# Altium schematic sheet BatteryBackpacks.SchDoc
size A
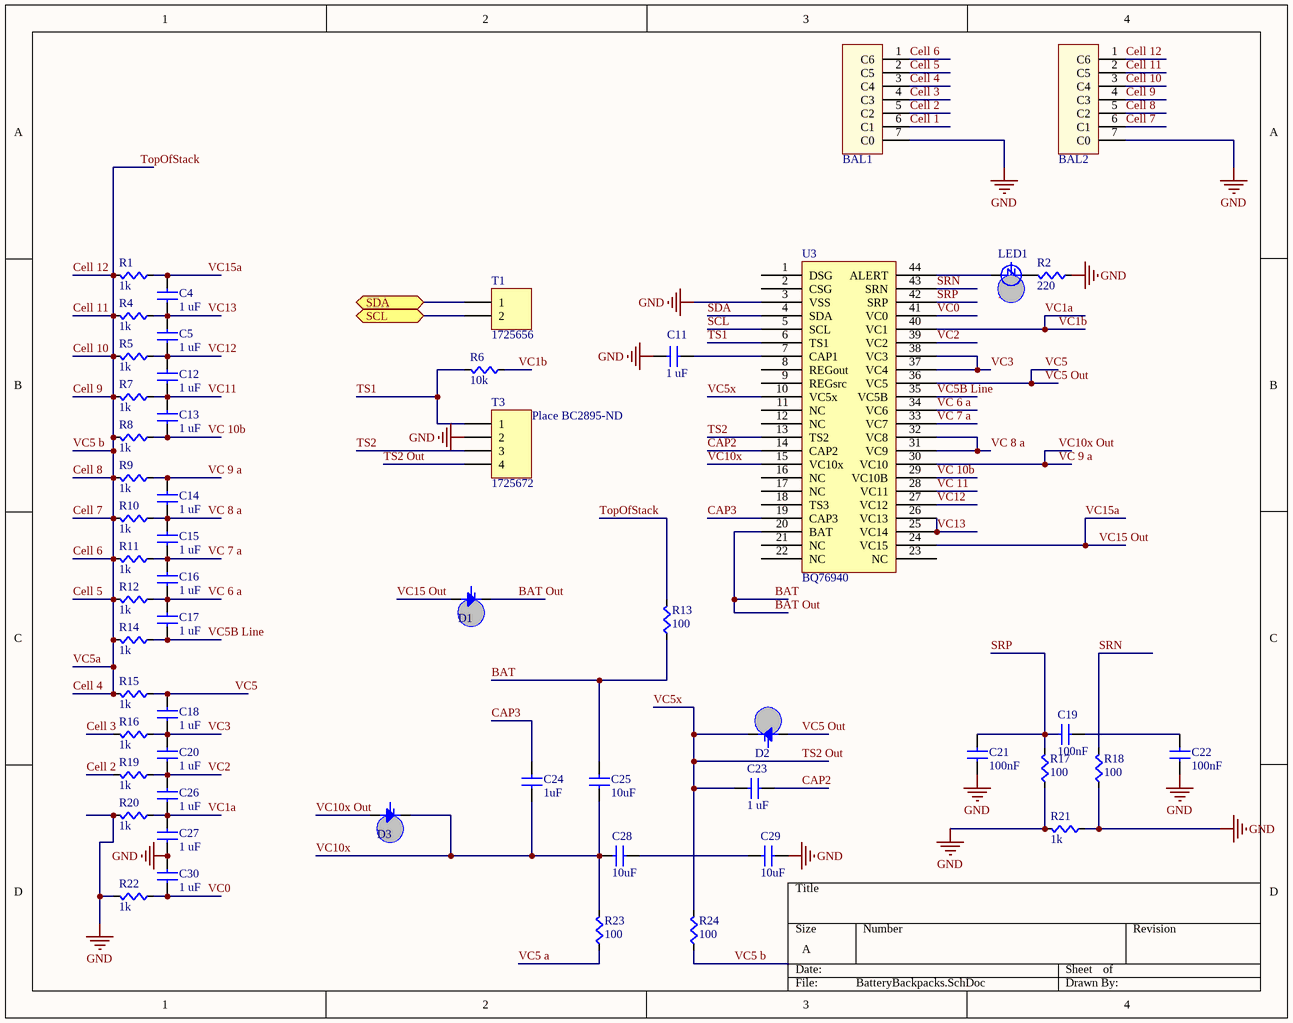
[diagram p0: BatteryBackpacks.SchDoc]

## Parts
BAL1  JST1x7  [JST1x7]  (value not drawn)
BAL2  JST1x7  [JST1x7]  (value not drawn)
C4  value 1 uF  [CAPC0603]  (hidden comment: Cap)
C5  value 1 uF  [CAPC0603]  (hidden comment: Cap)
C11  value 1 uF  [CAPC0603]  (hidden comment: Cap)
C12  value 1 uF  [CAPC0603]  (hidden comment: Cap)
C13  value 1 uF  [CAPC0603]  (hidden comment: Cap)
C14  value 1 uF  [CAPC0603]  (hidden comment: Cap)
C15  value 1 uF  [CAPC0603]  (hidden comment: Cap)
C16  value 1 uF  [CAPC0603]  (hidden comment: Cap)
C17  value 1 uF  [CAPC0603]  (hidden comment: Cap)
C18  value 1 uF  [CAPC0603]  (hidden comment: Cap)
C19  value 100nF  [CAPC0603]  (hidden comment: Cap)
C20  value 1 uF  [CAPC0603]  (hidden comment: Cap)
C21  value 100nF  [CAPC0603]  (hidden comment: Cap)
C22  value 100nF  [CAPC0603]  (hidden comment: Cap)
C23  value 1 uF  [CAPC0603]  (hidden comment: Cap)
C24  value 1uF  [CAPC0603]  (hidden comment: Cap)
C25  value 10uF  [CAPC0603]  (hidden comment: Cap)
C26  value 1 uF  [CAPC0603]  (hidden comment: Cap)
C27  value 1 uF  [CAPC0603]  (hidden comment: Cap)
C28  value 10uF  [CAPC0603]  (hidden comment: Cap)
C29  value 10uF  [CAPC0603]  (hidden comment: Cap)
C30  value 1 uF  [CAPC0603]  (hidden comment: Cap)
D1  Diode  [TEMD5510FX01]  (value not drawn)
D2  Diode  [TEMD5510FX01]  (value not drawn)
D3  Diode  [TEMD5510FX01]  (value not drawn)
LED1  Color: Red  [LED0603]  (hidden comment: LED)
R1  value 1k  [RES0603]  (hidden comment: Res)
R2  value 220  [RES0603]  (hidden comment: Res)
R4  value 1k  [RES0603]  (hidden comment: Res)
R5  value 1k  [RES0603]  (hidden comment: Res)
R6  value 10k  [RES0603]  (hidden comment: Res)
R7  value 1k  [RES0603]  (hidden comment: Res)
R8  value 1k  [RES0603]  (hidden comment: Res)
R9  value 1k  [RES0603]  (hidden comment: Res)
R10  value 1k  [RES0603]  (hidden comment: Res)
R11  value 1k  [RES0603]  (hidden comment: Res)
R12  value 1k  [RES0603]  (hidden comment: Res)
R13  value 100  [RES0603]  (hidden comment: Res)
R14  value 1k  [RES0603]  (hidden comment: Res)
R15  value 1k  [RES0603]  (hidden comment: Res)
R16  value 1k  [RES0603]  (hidden comment: Res)
R17  value 100  [RES0603]  (hidden comment: Res)
R18  value 100  [RES0603]  (hidden comment: Res)
R19  value 1k  [RES0603]  (hidden comment: Res)
R20  value 1k  [RES0603]  (hidden comment: Res)
R21  value 1k  [RES0603]  (hidden comment: Res)
R22  value 1k  [RES0603]  (hidden comment: Res)
R23  value 100  [RES0603]  (hidden comment: Res)
R24  value 100  [RES0603]  (hidden comment: Res)
T1  1725656  [1725656]
T3  1725672  [1725672]
U3  BQ76940  [BQ7694003DBT]

## Ports
SCL, SDA

## Nets
GND: BAL1.7(C0) BAL2.7(C0) C11.1(A) C21.2(B) C22.2(B) C27.1(A) C29.2(B) C30.2(B) R2.2(B) R17.2(B) R18.2(B) R20.1(A) R21.1(A) R21.2(B) R22.1(A) T3.2 U3.3(VSS)
BAT: C25.1(A) D1.C R13.2(B) U3.20(BAT)  [also labelled BAT Out]
CAP2: C23.2(B) U3.14(CAP2)
CAP3: C24.1(A) U3.19(CAP3)
Cell 1: BAL1.6(C1)
Cell 2: BAL1.5(C2) R19.1(A)
Cell 3: BAL1.4(C3) R16.1(A)
Cell 10: BAL1.1(C6) BAL1.2(C5) BAL1.3(C4) BAL2.1(C6) BAL2.2(C5) BAL2.3(C4) BAL2.4(C3) BAL2.5(C2) BAL2.6(C1) R1.1(A) R4.1(A) R5.1(A) R7.1(A) R8.1(A) R9.1(A) R10.1(A) R11.1(A) R12.1(A) R13.1(A) R14.1(A) R15.1(A) R24.2(B)  [also labelled Cell 11, Cell 12, Cell 4, Cell 5, Cell 6, Cell 7, Cell 8, Cell 9, TopOfStack, VC5 b, VC5a]
SCL: U3.5(SCL)
SCL: T1.2 ; port SCL  [a separate net that carries the same name]
SDA: U3.4(SDA)
SDA: T1.1 ; port SDA  [a separate net that carries the same name]
SRN: R18.1(A) U3.43(SRN)
SRP: C19.1(A) C21.1(A) R17.1(A) U3.42(SRP)
TS1: R6.1(A) T3.1 U3.6(TS1)
TS2: T3.3 U3.13(TS2)
TS2 Out: C23.1(A) D2.C R24.1(A) T3.4 U3.10(VC5x)  [also labelled VC5x]
VC0: C30.1(A) R22.2(B) U3.41(VC0)
VC1a: C26.1(A) C27.2(B) R6.2(B) R20.2(B) U3.40(VC1)  [also labelled VC1b]
VC2: C20.1(A) C26.2(B) R19.2(B) U3.39(VC2)
VC3: C18.1(A) C20.2(B) R16.2(B) U3.37(VC4) U3.38(VC3)
VC5: C18.2(B) D2.A R15.2(B) U3.36(VC5)  [also labelled VC5 Out]
VC5 a: R23.2(B)
VC5B Line: C17.1(A) R14.2(B) U3.35(VC5B)
VC10x: C24.2(B) C25.2(B) C28.1(A) D3.C R23.1(A) U3.15(VC10x)
VC11: C12.1(A) C13.2(B) R7.2(B)
VC12: C5.1(A) C12.2(B) R5.2(B) U3.27(VC12)
VC13: C4.1(A) C5.2(B) R4.2(B) U3.25(VC14) U3.26(VC13)
VC15 Out: C4.2(B) D1.A R1.2(B) U3.24(VC15)  [also labelled VC15a]
VC 6 a: C16.1(A) C17.2(B) R12.2(B) U3.34(VC6)
VC 7 a: C15.1(A) C16.2(B) R11.2(B) U3.33(VC7)
VC 8 a: C14.1(A) C15.2(B) R10.2(B) U3.31(VC9) U3.32(VC8)
VC 9 a: C14.2(B) D3.A R9.2(B) U3.30(VC10)  [also labelled VC10x Out]
VC 10b: C13.1(A) R8.2(B) U3.29(VC10B)
VC 11: U3.28(VC11)
NetC11_2: C11.2(B) U3.7(CAP1)
NetC19_2: C19.2(B) C22.1(A)
NetC28_2: C28.2(B) C29.1(A)
NetLED1_A: LED1.A U3.44(ALERT)
NetLED1_C: LED1.C R2.1(A)

Not connected (* = marked no-connect by the designer): U3 1(DSG) 2(CSG) 8(REGout) 9(REGsrc) 11(NC) 12(NC) 16(NC) 17(NC) 18(TS3) 21(NC) 22(NC) 23(NC)

## Notes on the sheet
- Place BC2895-ND

## Library data of the parts
BAL1 BAL2 = JST1x7: CONN HEADER XH SIDE 7POS 2.5MM; Supplier 1: Digi-Key; Supplier Part Number 1: 455-2240-ND
D1-D3 = Diode: Standard Diode Template
T1 = 1725656: CONN TERM BLOCK 2.54MM 2POS; Supplier 1: Digi-Key; Supplier Part Number 1: 277-1273-ND
T3 = 1725672: CONN TERM BLOCK 2.54MM 4POS; Supplier 1: Digi-Key; Supplier Part Number 1: 277-1275-ND
U3 = BQ76940: IC BATT MFMT LI-ION AFE 44TSOP; Supplier 1: Digi-Key; Supplier Part Number 1: 296-37789-5-ND
C4 C5 C11-C30 = Cap: Supplier 1: Digi-Key
  C4 C5 C11-C18 C20 C23 C24 C26 C27 C30: Supplier Part Number 1: 1276-1946-1-ND
  C19 C21 C22: Supplier Part Number 1: 1276-1000-1-ND
  C25 C28 C29: Supplier Part Number 1: 587-3383-1-ND
LED1 = LED: Supplier 1: Digi-Key; Supplier Part Number 1: 754-1122-1-ND
R1 R2 R4-R24 = Res: Supplier 1: Digi-Key
  R1 R4 R5 R7-R12 R14-R16 R19-R22: Supplier Part Number 1: RHM1.00KCFCT-ND
  R2: Supplier Part Number 1: RHM220CGCT-ND
  R6: Supplier Part Number 1: RMCF0603JT10K0CT-ND
  R13 R17 R18 R23 R24: Supplier Part Number 1: P100GCT-ND